# EAGLE design p128 (EAGLE 9.6.2)
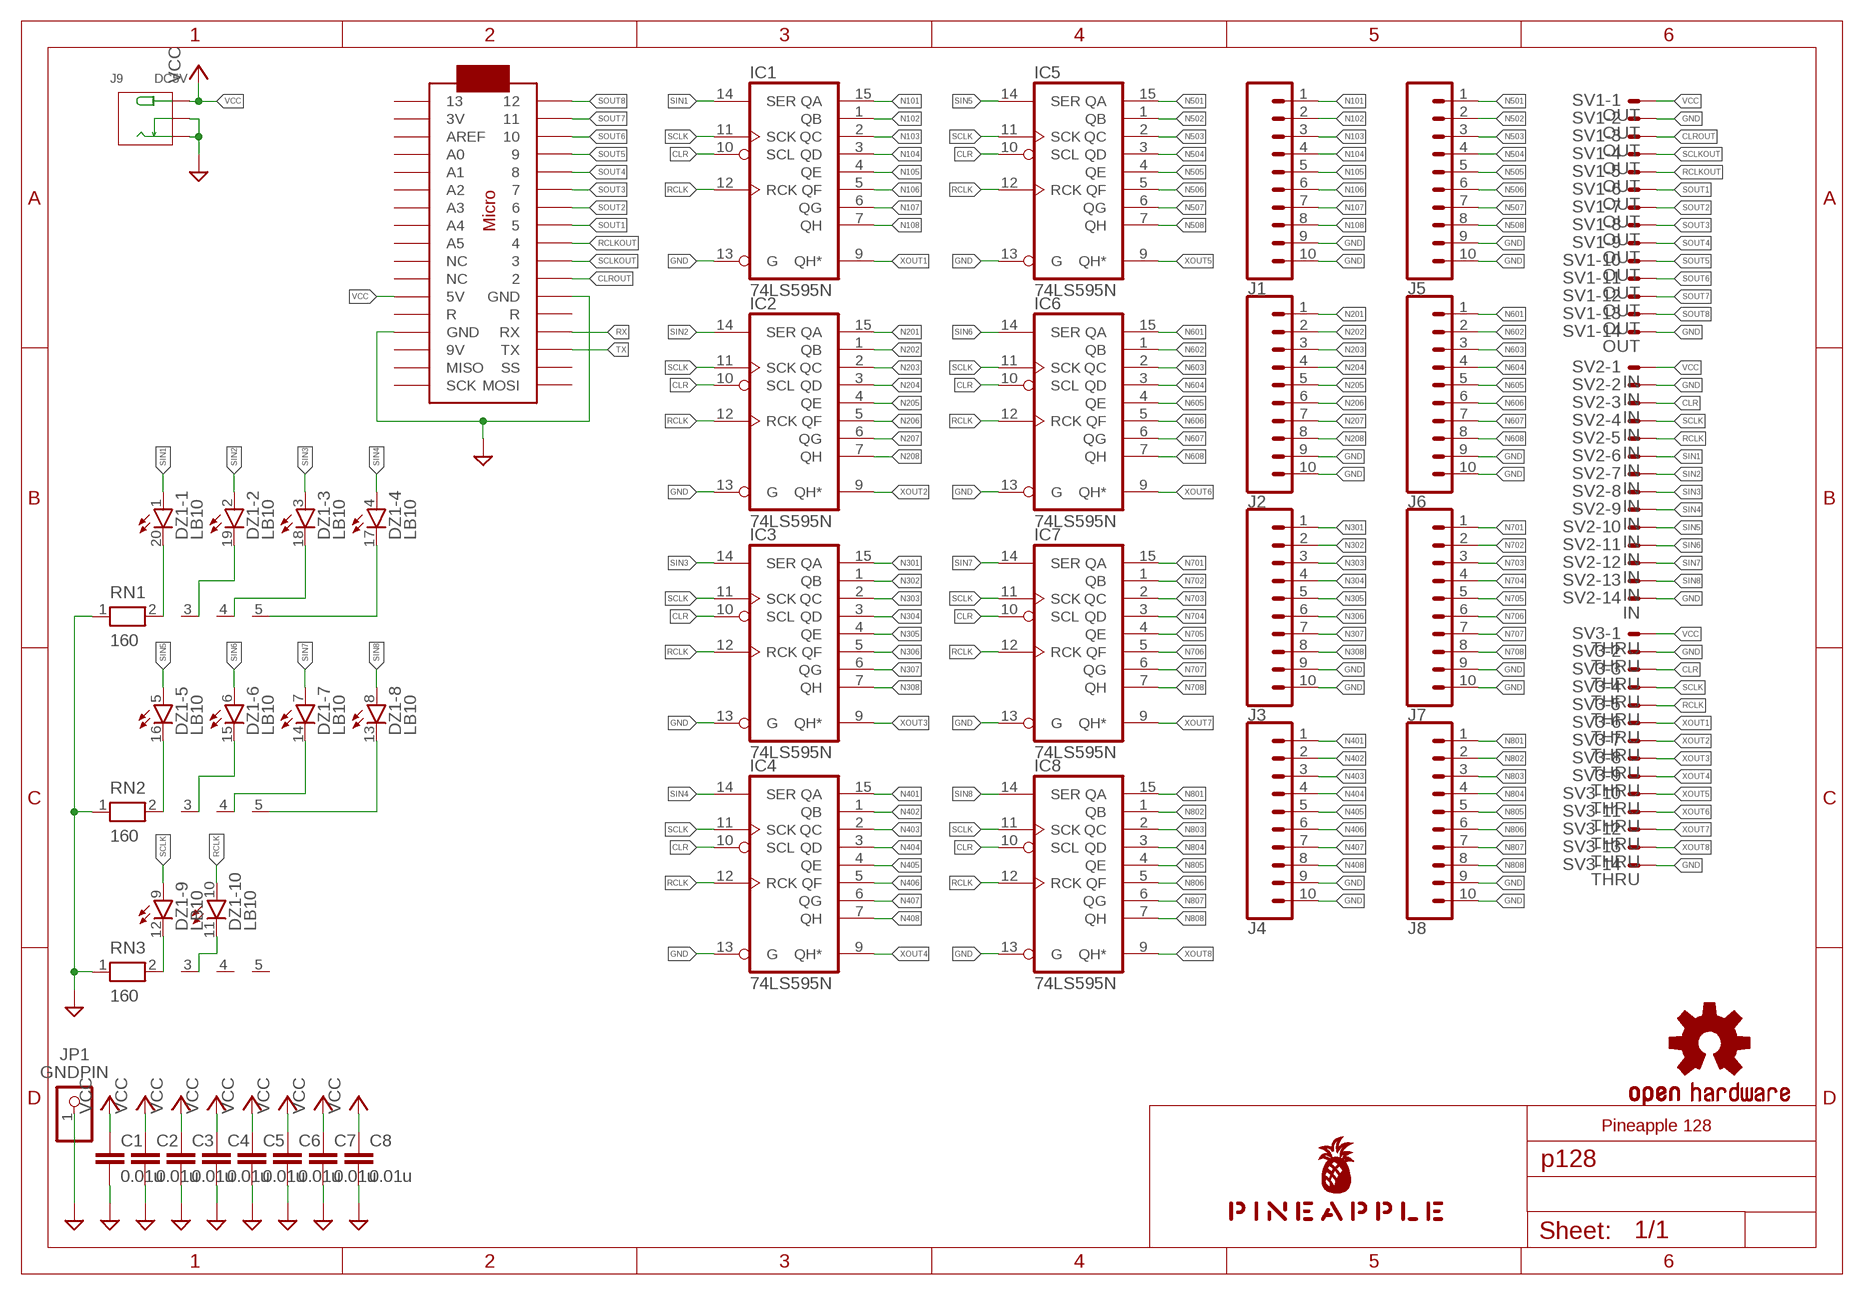
[diagram p0: schematic, sheet 1]

## Parts
C1  0.01u  C-EU025-024X044  [C025-024X044]
C2  0.01u  C-EU025-024X044  [C025-024X044]
C3  0.01u  C-EU025-024X044  [C025-024X044]
C4  0.01u  C-EU025-024X044  [C025-024X044]
C5  0.01u  C-EU025-024X044  [C025-024X044]
C6  0.01u  C-EU025-024X044  [C025-024X044]
C7  0.01u  C-EU025-024X044  [C025-024X044]
C8  0.01u  C-EU025-024X044  [C025-024X044]
DZ1  LB10  [LB10]
IC1  74LS595N  [DIL16]
IC2  74LS595N  [DIL16]
IC3  74LS595N  [DIL16]
IC4  74LS595N  [DIL16]
IC5  74LS595N  [DIL16]
IC6  74LS595N  [DIL16]
IC7  74LS595N  [DIL16]
IC8  74LS595N  [DIL16]
J1  CONN_10"  [1X10]
J2  CONN_10"  [1X10]
J3  CONN_10"  [1X10]
J4  CONN_10"  [1X10]
J5  CONN_10"  [1X10]
J6  CONN_10"  [1X10]
J7  CONN_10"  [1X10]
J8  CONN_10"  [1X10]
J9  DC5V  JACK-DC-005'DC-005'  [3P-L14.2*W11.0*H9.0MM]
JP1  GNDPIN  PINHD-1X1  [1X01]
LOGO1  OSHW-LOGOS-COPPER  [OSHW-LOGO-S_COPPER]
RN1  160  RN04  [RN-5]
RN2  160  RN04  [RN-5]
RN3  160  RN04  [RN-5]
SV1  OUT  ML14E  [ML14]
SV2  IN  ML14E  [ML14]
SV3  THRU  ML14E  [ML14]
U$1  PINEAPPLE450_SILK  [PINEAPPLE450_SILK]
U$2  ARDUINOMICRO  [ARDUINOMICRO]

## Nets
CLR: IC1.10(SCL) IC2.10(SCL) IC3.10(SCL) IC4.10(SCL) IC5.10(SCL) IC6.10(SCL) IC7.10(SCL) IC8.10(SCL) SV2.3 SV3.3
CLROUT: SV1.3 U$2.P$11
GND [gnd]: C1.2 C2.2 C3.2 C4.2 C5.2 C6.2 C7.2 C8.2 IC1.13(G) IC2.13(G) IC3.13(G) IC4.13(G) IC5.13(G) IC6.13(G) IC7.13(G) IC8.13(G) J1.9 J1.10 J2.9 J2.10 J3.9 J3.10 J4.9 J4.10 J5.9 J5.10 J6.9 J6.10 J7.9 J7.10 J8.9 J8.10 J9.-1(-) J9.-2(CDN) JP1.1 RN1.1 RN2.1 RN3.1 SV1.2 SV1.14 SV2.2 SV2.14 SV3.2 SV3.14 U$2.P$12(GND) U$2.P$21(GND)
N101: IC1.15(QA) J1.1
N102: IC1.1(QB) J1.2
N103: IC1.2(QC) J1.3
N104: IC1.3(QD) J1.4
N105: IC1.4(QE) J1.5
N106: IC1.5(QF) J1.6
N107: IC1.6(QG) J1.7
N108: IC1.7(QH) J1.8
N201: IC2.15(QA) J2.1
N202: IC2.1(QB) J2.2
N203: IC2.2(QC) J2.3
N204: IC2.3(QD) J2.4
N205: IC2.4(QE) J2.5
N206: IC2.5(QF) J2.6
N207: IC2.6(QG) J2.7
N208: IC2.7(QH) J2.8
N301: IC3.15(QA) J3.1
N302: IC3.1(QB) J3.2
N303: IC3.2(QC) J3.3
N304: IC3.3(QD) J3.4
N305: IC3.4(QE) J3.5
N306: IC3.5(QF) J3.6
N307: IC3.6(QG) J3.7
N308: IC3.7(QH) J3.8
N401: IC4.15(QA) J4.1
N402: IC4.1(QB) J4.2
N403: IC4.2(QC) J4.3
N404: IC4.3(QD) J4.4
N405: IC4.4(QE) J4.5
N406: IC4.5(QF) J4.6
N407: IC4.6(QG) J4.7
N408: IC4.7(QH) J4.8
N501: IC5.15(QA) J5.1
N502: IC5.1(QB) J5.2
N503: IC5.2(QC) J5.3
N504: IC5.3(QD) J5.4
N505: IC5.4(QE) J5.5
N506: IC5.5(QF) J5.6
N507: IC5.6(QG) J5.7
N508: IC5.7(QH) J5.8
N601: IC6.15(QA) J6.1
N602: IC6.1(QB) J6.2
N603: IC6.2(QC) J6.3
N604: IC6.3(QD) J6.4
N605: IC6.4(QE) J6.5
N606: IC6.5(QF) J6.6
N607: IC6.6(QG) J6.7
N608: IC6.7(QH) J6.8
N701: IC7.15(QA) J7.1
N702: IC7.1(QB) J7.2
N703: IC7.2(QC) J7.3
N704: IC7.3(QD) J7.4
N705: IC7.4(QE) J7.5
N706: IC7.5(QF) J7.6
N707: IC7.6(QG) J7.7
N708: IC7.7(QH) J7.8
N801: IC8.15(QA) J8.1
N802: IC8.1(QB) J8.2
N803: IC8.2(QC) J8.3
N804: IC8.3(QD) J8.4
N805: IC8.4(QE) J8.5
N806: IC8.5(QF) J8.6
N807: IC8.6(QG) J8.7
N808: IC8.7(QH) J8.8
N$1: DZ1.20(-1:C) RN1.2
N$2: DZ1.19(-2:C) RN1.3
N$3: DZ1.18(-3:C) RN1.4
N$4: DZ1.17(-4:C) RN1.5
N$5: DZ1.16(-5:C) RN2.2
N$6: DZ1.15(-6:C) RN2.3
N$7: DZ1.14(-7:C) RN2.4
N$8: DZ1.13(-8:C) RN2.5
N$9: DZ1.12(-9:C) RN3.2
N$10: DZ1.11(-10:C) RN3.3
RCLK: DZ1.10(-10:A) IC1.12(RCK) IC2.12(RCK) IC3.12(RCK) IC4.12(RCK) IC5.12(RCK) IC6.12(RCK) IC7.12(RCK) IC8.12(RCK) SV2.5 SV3.5
RCLKOUT: SV1.5 U$2.P$9
RX: U$2.P$14(RX)
SCLK: DZ1.9(-9:A) IC1.11(SCK) IC2.11(SCK) IC3.11(SCK) IC4.11(SCK) IC5.11(SCK) IC6.11(SCK) IC7.11(SCK) IC8.11(SCK) SV2.4 SV3.4
SCLKOUT: SV1.4 U$2.P$10
SIN1: DZ1.1(-1:A) IC1.14(SER) SV2.6
SIN2: DZ1.2(-2:A) IC2.14(SER) SV2.7
SIN3: DZ1.3(-3:A) IC3.14(SER) SV2.8
SIN4: DZ1.4(-4:A) IC4.14(SER) SV2.9
SIN5: DZ1.5(-5:A) IC5.14(SER) SV2.10
SIN6: DZ1.6(-6:A) IC6.14(SER) SV2.11
SIN7: DZ1.7(-7:A) IC7.14(SER) SV2.12
SIN8: DZ1.8(-8:A) IC8.14(SER) SV2.13
SOUT1: SV1.6 U$2.P$8
SOUT2: SV1.7 U$2.P$7
SOUT3: SV1.8 U$2.P$6
SOUT4: SV1.9 U$2.P$5
SOUT5: SV1.10 U$2.P$4
SOUT6: SV1.11 U$2.P$3
SOUT7: SV1.12 U$2.P$2
SOUT8: SV1.13 U$2.P$1
TX: U$2.P$15(TX)
VCC [power]: C1.1 C2.1 C3.1 C4.1 C5.1 C6.1 C7.1 C8.1 J9.+ SV1.1 SV2.1 SV3.1 U$2.P$23(5V)
XOUT1: IC1.9(QH*) SV3.6
XOUT2: IC2.9(QH*) SV3.7
XOUT3: IC3.9(QH*) SV3.8
XOUT4: IC4.9(QH*) SV3.9
XOUT5: IC5.9(QH*) SV3.10
XOUT6: IC6.9(QH*) SV3.11
XOUT7: IC7.9(QH*) SV3.12
XOUT8: IC8.9(QH*) SV3.13
Unconnected: RN3.4 RN3.5 U$2.P$13(R) U$2.P$16(SS) U$2.P$17(MOSI) U$2.P$18(SCK) U$2.P$19(MISO) U$2.P$20(9V) U$2.P$22(R) U$2.P$24(NC) U$2.P$25(NC) U$2.P$26(A5) U$2.P$27(A4) U$2.P$28(A3) U$2.P$29(A2) U$2.P$30(A1) U$2.P$31(A0) U$2.P$32(AREF) U$2.P$33(3V) U$2.P$34

## Notes on the sheet
- Pineapple 128

## Power pins joined to a net without a drawn wire
GND: IC1.8(GND) IC2.8(GND) IC3.8(GND) IC4.8(GND) IC5.8(GND) IC6.8(GND) IC7.8(GND) IC8.8(GND)
VCC: IC1.16(VCC) IC2.16(VCC) IC3.16(VCC) IC4.16(VCC) IC5.16(VCC) IC6.16(VCC) IC7.16(VCC) IC8.16(VCC)

## Library data of the parts
C1-C8 = resistor:C-EU: CAPACITOR, European symbol
DZ1 = led:LB10: LED BLOCK 10-LED bar graph, DIL, Siemens
IC1-IC8 = 74xx-us:74*595: 8-bit SHIFT REGISTER, output latch
J1-J8 = SparkFun-Connectors:CONN_10: Multi connection point. Often used as Generic Header-pin footprint for 0.1 inch spaced/style header connections On any of the 0.1 inch spaced packages, you can populate with these: Break Away Headers - Straight <https://www.sparkfun.com/products/116> (PRT-00116) Break Away Male Headers - Right Angle <https://www.sparkfun.com/products/553> (PRT-00553) Female Headers <https://www.sparkfun.com/products/115> (PRT-00115) Break Away Headers - Machine Pin <https://www.sparkfun.com/products/117> (PRT-00117) Break Away Female Headers - Swiss Machine Pin <https://www.sparkfun.com/products/743> (PRT-00743) Arduino Stackable Header - 10 Pin <https://www.sparkfun.com/products/11376> (PRT-11376) For SCREWTERMINALS and SPRING TERMINALS visit here: Screw Terimnals on SparkFun.com <https://www.sparkfun.com/search/results?term=Screw+Terminals> (5mm/3.5mm/2.54mm spacing) This device is also useful as a general connection point to wire up your design to another part of your project. Our various solder wires solder well into these plated through hole pads. Hook-Up Wire - Assortment (Stranded, 22 AWG) <https://www.sparkfun.com/products/11375> (PRT-11375) Hook-Up Wire - Assortment (Solid Core, 22 AWG) <https://www.sparkfun.com/products/11367> (PRT-11367) View the entire wire category on our website here <https://www.sparkfun.com/categories/141> Special notes: Molex polarized connector foot print use with SKU : PRT-08231 with associated crimp pins and housings. 1MM SMD Version SKU: PRT-10208 NOTES ON THE VARIANTS LOCK and LOCK_LONGPADS... This footprint was designed to help hold the alignment of a through-hole component (i.e. 6-pin header) while soldering it into place. You may notice that each hole has been shifted either up or down by 0.005 of an inch from it's more standard position (which is a perfectly straight line). This slight alteration caused the pins (the squares in the middle) to touch the edges of the holes. Because they are alternating, it causes a "brace" to hold the component in place. 0.005 has proven to be the perfect amount of "off-center" position when using our standard breakaway headers. Although looks a little odd when you look at the bare footprint, once you have a header in there, the alteration is very hard to notice. Also,if you push a header all the way into place, it is covered up entirely on the bottom side.; PROD_ID: CONN-11563
J9 = Seeed-Connector:JACK-DC-005: 320120003
JP1 = pinhead:PINHD-1X1: PIN HEADER
LOGO1 = SparkFun-Aesthetics:OSHW-LOGO: Open-Source Hardware (OSHW) Logo This logo indicates the piece of hardware it is found on incorporates a OSHW license and/or adheres to the definition of open source hardware found here: http://freedomdefined.org/OSHW
RN1-RN3 = resistor-net:RN04: RESISTOR NETWORK; OC_FARNELL: unknown; OC_NEWARK: unknown
SV1-SV3 = con-ml:ML14E: HARTING; OC_FARNELL: unknown; OC_NEWARK: unknown
U$1 = pineapple:PINEAPPLE450_SILK
U$2 = adafruit:ARDUINOMICRO

## Net classes
0 default: width 0.152 mm, drill 0.152 mm, clearance 0.152 mm
1 gnd: width 0.305 mm, drill 0.152 mm, clearance 0.152 mm
2 power: width 0.305 mm, drill 0.152 mm, clearance 0.152 mm
3 analog: width 0.152 mm, drill 0.152 mm, clearance 0.152 mm

## Board
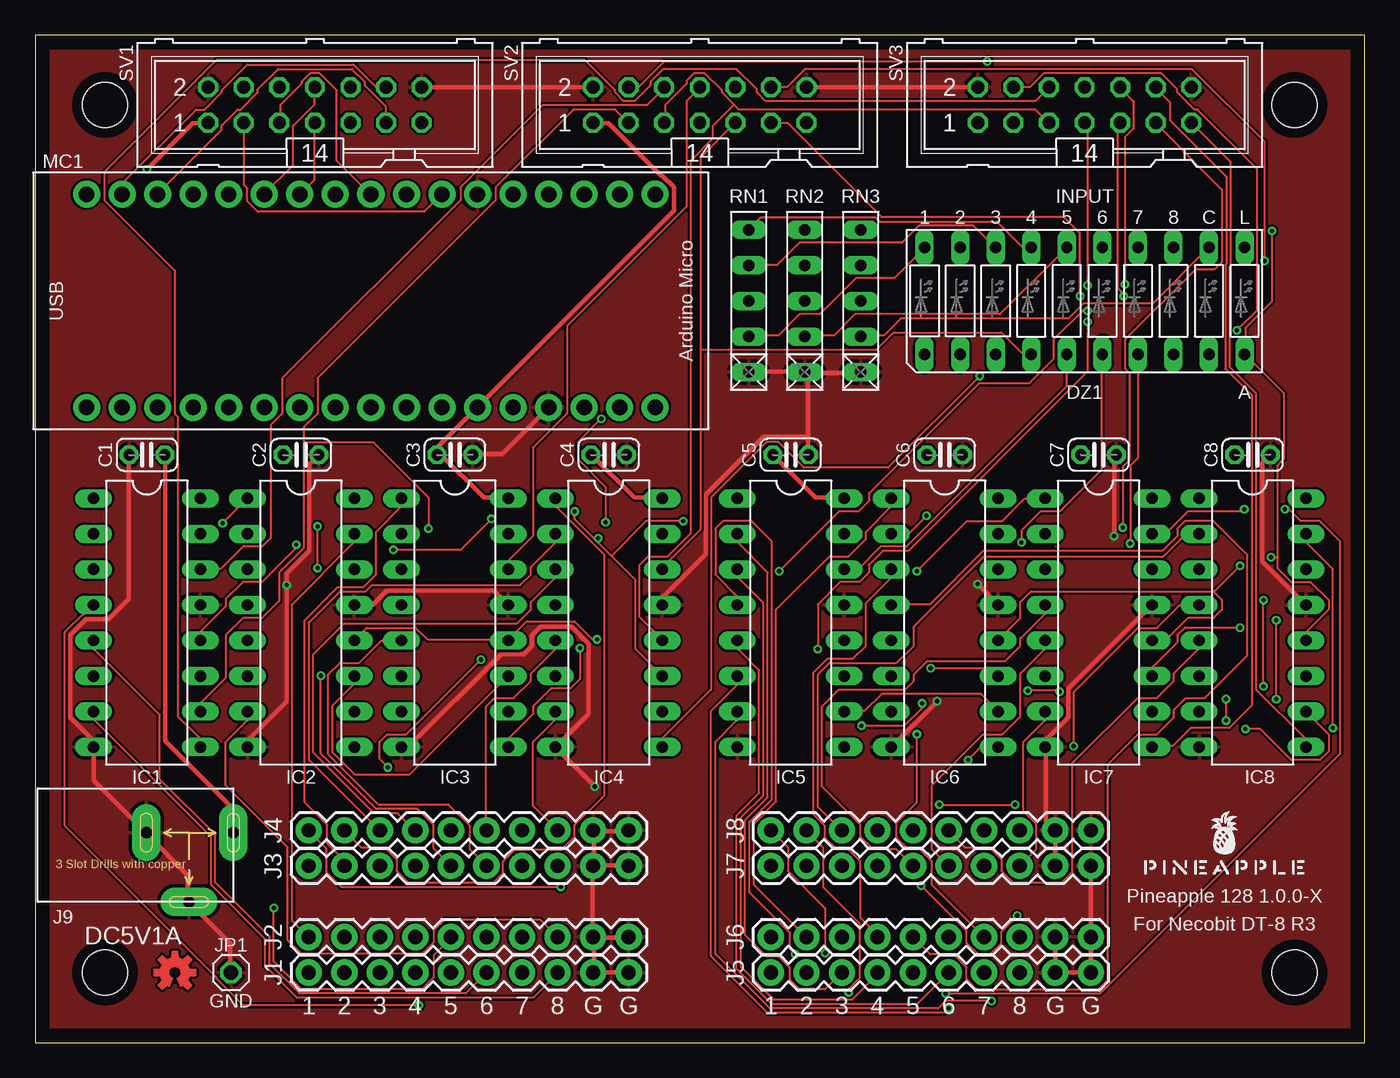
[diagram p1: board, top side]
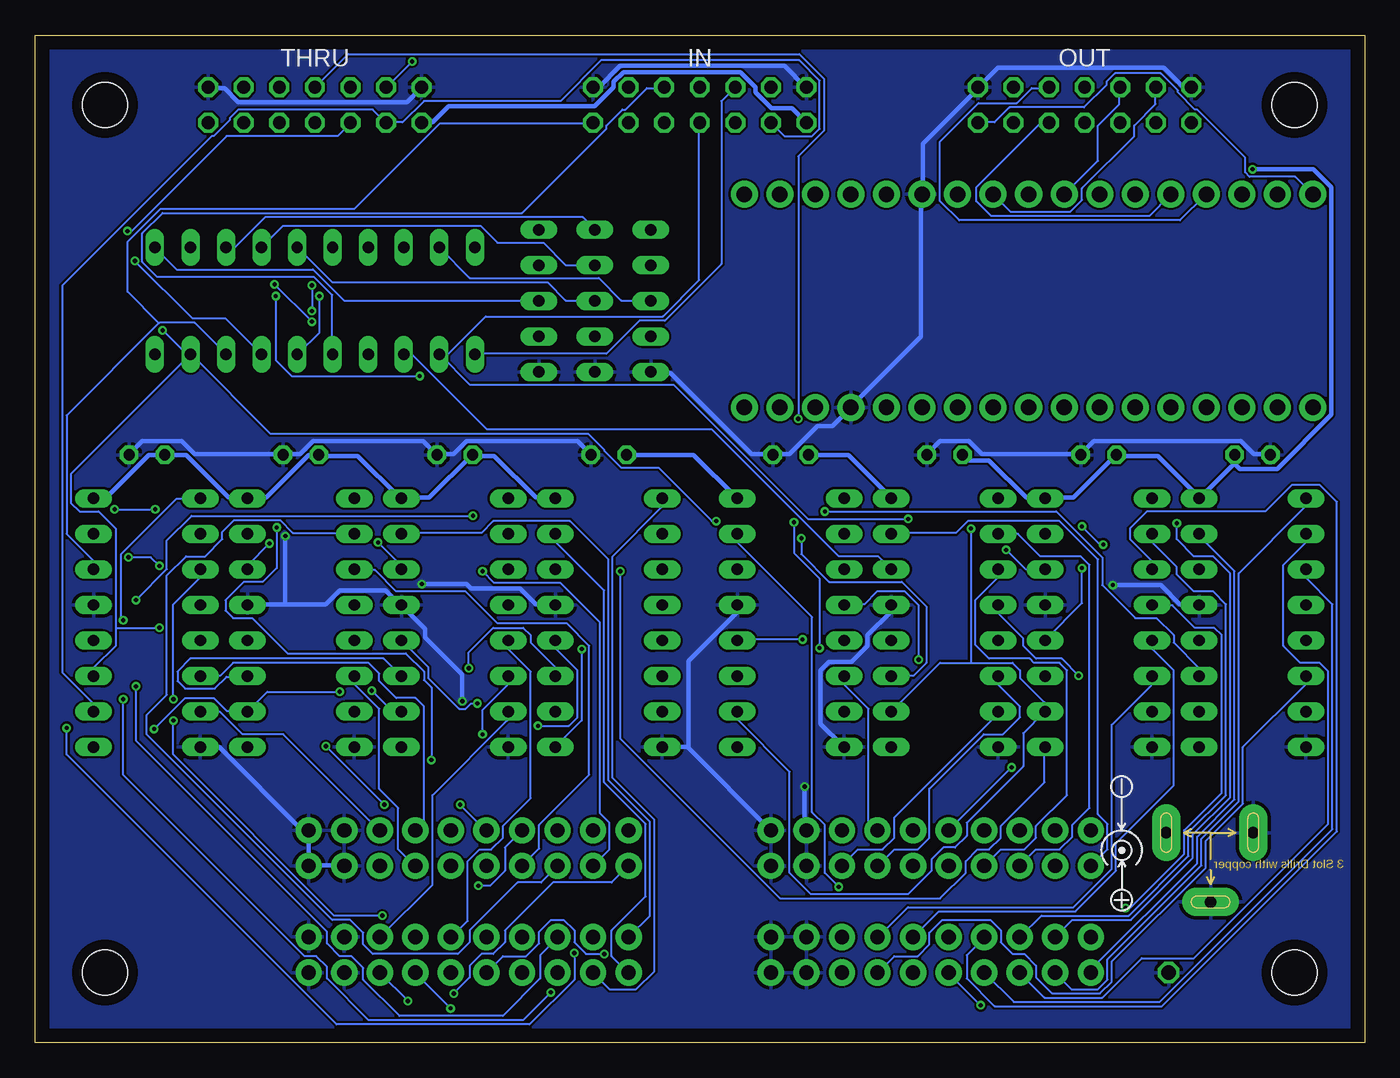
[diagram p2: board, bottom side, seen from below]

Size 95 x 72 mm. Coordinates in mm from the lower left corner, seen from the top.
Outline: 0,0 95,0 95,72 0,72 0,0
Copper layers (1*16): Top 0.035mm / dielectric 1.5mm / Bottom 0.035mm
Design rules "SeeedStudio_2layer_DRU_no_angle_20140221": minimum track width 6mil, minimum drill 12mil, track to track 6mil, track to pad 6mil, pad to pad 6mil, via to via 6mil, smd to smd 0mil, copper to edge 10mil, drill to drill 10mil, minimum pad ring 10mil, minimum via ring 6mil, stop-mask expansion 2mil, vias tented up to drill 100mil, thermal gap 10mil
Holes 3.2 mm at 5,5 90,5 90,67 5,67
tRestrict: area 2.8,64.8 to 7.2,69.2; area 87.8,64.8 to 92.2,69.2; area 2.8,2.8 to 7.2,7.2; area 87.8,2.8 to 92.2,7.2; area 0,71 to 95,72; area 94,0 to 95,72; area 0,0 to 95,1; area 0,0 to 1,72
bRestrict: area 2.8,2.8 to 7.2,7.2; area 87.8,2.8 to 92.2,7.2; area 87.8,64.8 to 92.2,69.2; area 2.8,64.8 to 7.2,69.2; area 0,71 to 95,72; area 94,0 to 95,72; area 0,0 to 95,1; area 0,0 to 1,72

### Footprints (pad centres in the part's own frame; a part is rotated, then mirrored left to right if it is on the bottom)
C025-024X044 = drill 0.813 octagon: 1 -1.27,0; 2 1.27,0
LB10 = drill 0.813 long: 1 -11.43,-3.81; 2 -8.89,-3.81; 3 -6.35,-3.81; 4 -3.81,-3.81; 5 -1.27,-3.81; 6 1.27,-3.81; 7 3.81,-3.81; 8 6.35,-3.81; 9 8.89,-3.81; 10 11.43,-3.81; 11 11.43,3.81; 12 8.89,3.81; 13 6.35,3.81; 14 3.81,3.81; 15 1.27,3.81; 16 -1.27,3.81; 17 -3.81,3.81; 18 -6.35,3.81; 19 -8.89,3.81; 20 -11.43,3.81
DIL16 = drill 0.813 long: 1 -8.89,-3.81; 2 -6.35,-3.81; 3 -3.81,-3.81; 4 -1.27,-3.81; 5 1.27,-3.81; 6 3.81,-3.81; 7 6.35,-3.81; 8 8.89,-3.81; 9 8.89,3.81; 10 6.35,3.81; 11 3.81,3.81; 12 1.27,3.81; 13 -1.27,3.81; 14 -3.81,3.81; 15 -6.35,3.81; 16 -8.89,3.81
1X10 = drill 1.016 pad 1.88: 1 0,0; 2 2.54,0; 3 5.08,0; 4 7.62,0; 5 10.16,0; 6 12.7,0; 7 15.24,0; 8 17.78,0; 9 20.32,0; 10 22.86,0
3P-L14.2*W11.0*H9.0MM = drill 0.813 pad 2.032 long: + 3.175,0; -1 -3.048,0; -2 0,-4.953
1X01 = drill 1.016 octagon: 1 0,0
RN-5 = drill 0.813 long: 1 -5.08,0; 2 -2.54,0; 3 0,0; 4 2.54,0; 5 5.08,0
ML14 = drill 0.914 octagon: 1 -7.62,-1.27; 2 -7.62,1.27; 3 -5.08,-1.27; 4 -5.08,1.27; 5 -2.54,-1.27; 6 -2.54,1.27; 7 0,-1.27; 8 0,1.27; 9 2.54,-1.27; 10 2.54,1.27; 11 5.08,-1.27; 12 5.08,1.27; 13 7.62,-1.27; 14 7.62,1.27
ARDUINOMICRO = drill 1.1 pad 1.93: P$1 -20.32,7.62; P$2 -17.78,7.62; P$3 -15.24,7.62; P$4 -12.7,7.62; P$5 -10.16,7.62; P$6 -7.62,7.62; P$7 -5.08,7.62; P$8 -2.54,7.62; P$9 0,7.62; P$10 2.54,7.62; P$11 5.08,7.62; P$12 12.7,-7.62; P$13 10.16,-7.62; P$14 12.7,7.62; P$15 15.24,7.62; P$16 17.78,7.62; P$17 20.32,7.62; P$18 20.32,-7.62; P$19 17.78,-7.62; P$20 15.24,-7.62; P$21 7.62,7.62; P$22 10.16,7.62; P$23 7.62,-7.62; P$24 5.08,-7.62; P$25 2.54,-7.62; P$26 0,-7.62; P$27 -2.54,-7.62; P$28 -5.08,-7.62; P$29 -7.62,-7.62; P$30 -10.16,-7.62; P$31 -12.7,-7.62; P$32 -15.24,-7.62; P$33 -17.78,-7.62; P$34 -20.32,-7.62

### Placement (x,y rotation side)
C1  8,42 180 top
C2  19,42 0 top
C3  30,42 0 top
C4  41,42 0 top
C5  54,42 0 top
C6  65,42 0 top
C7  76,42 0 top
C8  87,42 0 top
DZ1  75,53 0 top
IC1  8,30 270 top
IC2  19,30 270 top
IC3  30,30 270 top
IC4  41,30 270 top
IC5  54,30 270 top
IC6  65,30 270 top
IC7  76,30 270 top
IC8  87,30 270 top
J1  19.56,5 0 top
J2  19.56,7.54 0 top
J3  19.56,12.62 0 top
J4  19.56,15.16 0 top
J5  52.58,5 0 top
J6  52.58,7.54 0 top
J7  52.58,12.62 0 top
J8  52.58,15.16 0 top
J9  11,15 0 top
JP1  14,5 0 top
LOGO1  10,5 0 top
RN1  51,53 90 top
RN2  55,53 90 top
RN3  59,53 90 top
SV1  20,67 0 top
SV2  47.5,67 0 top
SV3  75,67 0 top
U$1  85,12 0 top
U$2  24,53 0 top

### Tracks (layer width: path | path; a pad name or v marks a point on that pad's centre or on a via)
CLR  (via drill 0.3)
  Top 0.152: IC5.10 57.84,23.7 59.28,23.7 60.5,24.92 67.59,24.92 68.81,23.7 IC6.10 | v86.49,22.4 87.55,22.4 89.76,20.19 91.82,20.19 92.43,20.8 92.43,22.02 90.83,23.62 IC8.10 | v70.94,25.15 73.15,25.15 v73.23,25.07 | 19.2,42.9 19.2,43.97 20.19,44.96 20.19,47.47 32.92,60.2 32.92,61.11 38.48,66.67 41.45,66.67 42.37,65.76 SV2.3 | 19.2,42.9 19.2,35.36 17.45,33.6 17.45,31.55 16.23,30.33 14.86,30.33 13.64,29.11 13.64,26.06 11.81,24.23 11.81,23.7 IC1.10 | v28.12,36.73 28.12,38.94 24.16,42.9 19.2,42.9
  Bottom 0.152: 28.12,27.13 30.33,27.13 33.76,23.7 IC3.10 | 28.12,27.13 25.15,27.13 24.61,26.59 24.61,26.06 22.86,24.31 22.86,23.7 IC2.10 22.86,23.62 24.38,22.1 24.38,19.74 28.42,15.7 28.42,14.78 29.26,13.95 30.1,13.95 30.94,13.11 30.94,12.27 32.61,10.59 39.55,10.59 41.07,12.12 41.07,19.36 44.81,23.09 44.81,23.62 IC4.10 | v86.49,22.4 84.28,24.61 82.22,24.61 81.31,23.7 79.86,23.7 IC7.10 79.78,23.7 78.41,25.07 v73.23,25.07 | v70.94,25.15 69.49,23.7 68.89,23.7 IC6.10 | SV2.3 42.37,65.68 41.45,64.77 39.47,64.77 38.94,65.3 38.94,68.73 40.39,70.18 54.56,70.18 57.45,67.28 67.21,67.28 68.73,65.76 69.88,65.76 SV3.3 69.95,65.76 70.87,66.67 80.47,66.67 81.08,66.06 81.08,65.91 82.22,64.77 82.37,64.77 93.04,54.1 93.04,26.44 90.83,24.23 90.83,23.7 IC8.10 | v28.12,36.73 28.12,27.13
CLROUT
  Top 0.152: SV1.3 14.94,65.68 14.94,61.27 15.16,61.04 15.16,60.12 15.93,59.36 27.81,59.36 29.03,60.58 U$2.P$11
GND  (via drill 0.3)
  Top 0.305: SV2.14 55.17,68.28 67.36,68.28 SV3.2 | SV2.2 39.85,68.28 27.66,68.28 SV1.14 | IC2.13 22.86,31.32 24.16,31.32 25.15,32.31 32.77,32.31 33.76,31.32 IC3.13 | IC3.8 26.21,21.18 26.75,21.18 33.3,27.74 34.9,27.74 35.51,28.35 35.51,29.11 36.12,29.72 38.33,29.72 39.55,28.5 39.55,23.47 37.26,21.18 IC4.8 37.26,21.03 v40.01,18.29 | J2.9 39.93,7.47 39.93,5.03 J1.9 40.08,5.03 42.37,5.03 J1.10 | J2.10 42.37,7.47 40.08,7.47 J2.9 | J3.9 39.93,12.65 39.93,15.09 J4.9 40.08,15.09 42.37,15.09 J4.10 | J3.10 42.37,12.65 40.08,12.65 J3.9 | J2.9 39.85,7.7 39.85,12.5 J3.9 | JP1.1 13.95,5.03 13.95,7.09 11.05,9.98 J9.-2 10.9,10.13 10.9,11.96 8,14.86 J9.-1 7.92,15.01 4.19,18.75 IC1.8 4.19,21.26 4.19,21.57 2.52,23.24 2.52,29.11 3.66,30.25 5.26,30.25 6.71,31.7 6.71,41.99 C1.2 | IC2.8 15.24,21.18 15.24,21.64 17.98,24.38 v17.98,32.69 17.98,33.53 19.58,35.13 19.58,41.3 20.27,41.99 C2.2 | J7.9 72.92,12.65 72.92,15.01 J8.9 72.85,15.16 72.24,15.77 72.24,21.11 IC7.8 72.24,21.26 72.24,21.64 73.84,23.24 73.84,25.3 79.78,31.24 IC7.13 | J6.9 72.92,7.47 72.92,5.03 J5.9 73.08,5.03 75.44,5.03 J5.10 75.44,5.18 75.44,7.47 J6.10 75.44,7.62 75.44,12.57 J7.10 | v67.36,32.77 68.81,31.32 IC6.13 | v64.47,24.38 61.27,21.18 IC6.8 | IC8.13 90.75,31.32 87.71,34.37 87.71,41.45 88.24,41.99 C8.2 | C3.2 31.32,42.06 33.38,42.06 36.65,45.34 U$2.P$12 | 55.24,43.28 55.24,47.62 55.02,47.85 RN2.1 | 55.24,43.28 55.24,42.06 C5.2 | RN1.1 51.05,47.93 54.86,47.93 RN2.1 | RN3.1 58.98,47.85 55.47,47.85 55.32,47.7 RN2.1 | v77.11,36.2 77.11,41.83 77.27,41.99 C7.2 | 55.24,43.28 52.05,43.28 47.93,39.17 47.93,34.9 44.88,31.85 44.88,31.32 IC4.13
  Bottom 0.305: SV3.14 82.6,68.2 81.46,68.2 80.47,67.21 68.43,67.21 67.44,68.2 SV3.2 | SV1.2 12.42,68.28 12.95,68.28 14.33,69.65 26.21,69.65 27.58,68.28 SV1.14 27.66,68.12 31.55,64.24 31.55,60.66 U$2.P$21 31.7,60.5 31.7,50.44 36.65,45.49 U$2.P$12 36.73,45.34 38.02,44.04 39.09,44.04 41.07,42.06 42.22,42.06 C4.2 42.37,42.06 43.81,42.06 49.61,47.85 50.98,47.85 RN1.1 | SV2.14 55.09,68.28 54.71,68.28 53.19,69.8 41.45,69.8 39.93,68.28 SV2.2 | IC3.13 33.83,31.24 33.83,30.79 35.51,29.11 35.51,28.35 36.65,27.2 38.25,27.2 38.86,26.59 38.86,22.78 37.26,21.18 IC4.8 | 48.39,21.11 50.14,21.11 IC5.8 | 48.39,21.11 42.44,15.16 J4.10 | IC4.13 44.88,31.24 44.88,30.71 48.31,27.28 48.31,21.18 48.39,21.11 | v40.01,18.29 40.01,15.24 39.93,15.16 J4.9 | v17.98,32.69 14.55,32.69 13.18,31.32 11.81,31.32 IC1.13 | C1.2 6.78,42.06 7.92,42.06 8.84,42.98 19.36,42.98 20.27,42.06 C2.2 20.42,42.06 27.36,42.06 28.27,42.98 30.33,42.98 31.24,42.06 C3.2 | IC8.8 83.13,21.11 81.84,21.11 75.89,15.16 75.51,15.16 J8.10 75.44,15.01 75.44,12.65 J7.10 75.29,12.65 72.92,12.65 J7.9 | v67.36,32.77 64.16,32.77 63.86,32.46 60.35,32.46 59.21,31.32 57.84,31.32 IC5.13 | v64.47,24.38 64.47,26.29 67.13,28.96 67.13,29.57 68.81,31.24 IC6.13 68.96,31.32 69.95,32.31 73.23,32.31 74.22,31.32 77.11,31.32 | 77.11,31.32 79.78,31.32 IC7.13 | C8.2 88.24,42.06 87.33,42.98 84.51,42.98 83.59,42.06 77.34,42.06 C7.2 77.19,42.06 76.05,42.06 75.13,42.98 67.28,42.98 66.37,42.06 C6.2 66.22,42.06 65.08,42.06 64.16,42.98 56.24,42.98 55.32,42.06 C5.2 | v77.11,36.2 77.11,31.32
  pour Top: -1,-1 96,-1 96,73 -1,73
  pour Bottom: -2,-2 97,-2 97,74 -2,74
N101
  Bottom 0.152: IC1.15 11.73,36.35 11.73,36.12 9.3,33.68 9.3,17.37 11.96,14.71 11.96,12.8 19.51,5.26 19.51,5.03 J1.1
N102
  Bottom 0.152: IC1.1 4.19,38.86 4.19,38.33 8.99,33.53 8.99,17.22 11.66,14.55 11.66,12.65 18.36,5.94 18.36,4.5 19.05,3.81 20.95,3.81 22.1,4.95 J1.2
N103
  Bottom 0.152: IC1.2 4.19,35.74 5.79,34.14 5.79,28.35 4.57,27.13 3.2,27.13 2.59,26.52 2.59,15.62 12.19,6.02 15.93,6.02 18.75,3.2 22.86,3.2 24.61,4.95 J1.3
N104
  Bottom 0.152: IC1.3 4.12,33.76 4.12,33.15 2.29,31.32 2.29,15.24 14.63,2.9 25.07,2.9 27.13,4.95 J1.4
N105  (via drill 0.3)
  Top 0.152: v27.43,2.67 14.86,2.67 12.95,4.57 12.95,4.65 2.13,15.47 2.13,29.34 3.43,30.63 3.5,30.63 4.12,31.24 IC1.4
  Bottom 0.152: v27.43,2.67 29.72,4.95 J1.5
N106
  Top 0.152: IC1.5 4.19,28.12 8.91,23.39 8.91,18.82 12.88,14.86 12.88,11.43 16.76,7.54 16.76,5.64 18.9,3.5 30.79,3.5 32.23,4.95 J1.6
N107
  Bottom 0.152: IC1.6 4.19,26.14 4.19,25.6 8.69,21.11 8.69,17.07 11.35,14.4 11.35,12.5 18.06,5.79 18.06,4.34 18.9,3.5 22.33,3.5 23.47,4.65 23.47,5.49 24.31,6.33 25.15,6.33 25.98,7.16 25.98,8 26.75,8.76 30.18,8.76 31.09,7.85 31.09,7.01 31.93,6.17 33.6,6.17 34.75,5.03 J1.7
N108
  Top 0.152: IC1.7 4.19,23.62 4.19,23.09 12.57,14.71 12.57,11.28 16.46,7.39 16.46,5.49 18.75,3.2 35.59,3.2 37.34,4.95 J1.8
N201
  Top 0.152: IC2.15 22.78,36.35 22.78,35.74 18.36,31.32 18.36,8.69 19.51,7.54 J2.1
N202  (via drill 0.3)
  Top 0.152: v13.41,37.11 15.16,38.86 IC2.1
  Bottom 0.152: v13.41,37.11 13.41,35.97 12.19,34.75 10.82,34.75 9.6,33.53 9.6,17.53 12.27,14.86 12.27,13.18 16.69,8.76 20.88,8.76 J2.2
N203
  Bottom 0.152: IC2.2 15.16,36.35 15.16,35.74 13.41,33.98 13.41,33.45 12.19,32.23 10.82,32.23 9.91,31.32 9.91,17.68 12.57,15.01 12.57,13.34 16.84,9.07 23.09,9.07 24.61,7.54 J2.3
N204
  Bottom 0.152: IC2.3 15.24,33.83 15.24,34.44 16.76,35.97 16.76,36.73 15.54,37.95 7.09,37.95 5.18,39.85 3.2,39.85 1.98,38.63 1.98,15.09 14.48,2.59 26.44,2.59 28.42,4.57 28.42,6.25 27.2,7.47 J2.4
N205  (via drill 0.3)
  Top 0.152: v17.07,9.6 17.07,5.79 19.05,3.81 27.66,3.81 28.5,4.65 28.5,6.25 29.72,7.47 J2.5
  Bottom 0.152: v17.07,9.6 16.76,9.6 12.88,13.49 12.88,15.16 10.21,17.83 10.21,29.11 10.74,29.64 12.12,29.64 13.72,31.24 15.16,31.24 IC2.4
N206
  Bottom 0.152: IC2.5 15.16,28.73 15.16,28.12 13.64,26.59 13.64,18.36 17.75,14.25 17.75,12.27 20.65,9.37 30.4,9.37 32.23,7.54 J2.6
N207
  Bottom 0.152: IC2.6 15.24,26.14 15.24,25.53 18.06,22.71 18.06,12.42 20.8,9.68 32.61,9.68 34.75,7.54 J2.7
N208
  Top 0.152: IC2.7 15.16,23.62 15.16,23.01 13.64,21.49 13.64,18.36 18.06,13.95 18.06,7.32 19.05,6.33 27.66,6.33 28.5,7.16 28.5,8 29.26,8.76 36.12,8.76 J2.8
N301
  Bottom 0.152: IC3.15 33.76,36.42 29.18,36.42 28.35,37.26 21.79,37.26 19.05,34.52 19.05,16.31 18.36,15.62 18.36,13.79 19.51,12.65 J3.1
N302
  Top 0.152: IC3.1 26.14,38.86 26.14,38.25 24.38,36.5 24.38,33.45 23.47,32.54 21.64,32.54 19.28,30.18 19.28,17.14 20.88,15.54 20.88,14.25 22.1,13.03 22.1,12.65 J3.2
N303
  Bottom 0.152: IC3.2 26.14,36.35 24.77,36.35 23.16,34.75 20.27,34.75 19.66,34.14 19.66,16.76 20.88,15.54 20.88,14.71 21.79,13.79 23.47,13.79 24.61,12.65 J3.3
N304
  Bottom 0.152: IC3.3 26.21,33.76 26.21,33.22 27.81,31.62 27.81,28.42 26.82,27.43 23.93,27.43 23.62,27.13 21.79,27.13 21.26,26.59 21.26,17.68 23.47,15.47 23.47,14.63 24.31,13.79 25.98,13.79 27.13,12.65 J3.4
N305  (via drill 0.3)
  Top 0.152: v20.42,26.21 20.42,20.65 24.38,16.69 27.36,16.69 28.5,15.54 28.5,13.87 29.72,12.65 J3.5
  Bottom 0.152: v20.42,26.21 21.64,27.43 23.47,27.43 24.38,28.35 24.38,28.88 26.14,30.63 26.14,31.24 IC3.4
N306
  Top 0.152: IC3.5 26.14,28.73 24.77,28.73 23.16,27.13 21.79,27.13 20.95,26.29 20.95,20.57 24.54,16.99 29.57,16.99 31.09,15.47 31.09,13.79 32.23,12.65 J3.6
N307
  Bottom 0.152: IC3.6 26.14,26.14 26.14,25.53 24.61,24 24.61,23.24 25.83,22.02 27.2,22.02 31.09,18.14 31.09,14.63 31.93,13.79 33.6,13.79 34.75,12.65 J3.7
N308
  Bottom 0.152: IC3.7 26.21,23.62 26.21,23.47 33.6,16.08 33.6,14.63 34.44,13.79 36.2,13.79 37.34,12.65 J3.8
N401  (via drill 0.3)
  Top 0.152: v37.57,11.12 21.87,11.12 20.8,12.19 20.8,13.87 19.58,15.09 J4.1
  Bottom 0.152: v37.57,11.12 38.56,12.12 38.56,15.54 39.47,16.46 39.47,30.4 44.81,35.74 IC4.15
N402
  Top 0.152: IC4.1 37.26,38.86 37.26,38.25 40.69,34.82 40.69,17.68 38.56,15.54 38.56,14.71 37.64,13.79 34.29,13.79 33.45,12.95 33.45,12.12 32.77,11.43 26.67,11.43 25.83,12.27 25.83,13.11 24.99,13.95 23.32,13.95 22.17,15.09 J4.2
N403
  Top 0.152: IC4.2 37.19,35.74 35.43,33.98 35.43,33.45 34.67,32.69 24.08,32.69 23.62,32.23 21.79,32.23 19.58,30.02 19.58,20.19 24.61,15.16 J4.3
N404
  Top 0.152: IC4.3 37.19,33.76 37.19,33.22 35.43,31.47 35.43,30.94 34.44,29.95 22.1,29.95 19.89,27.74 19.89,20.73 24.23,16.38 25.91,16.38 27.13,15.16 J4.4
N405  (via drill 0.3)
  Top 0.152: v31.85,27.36 26.52,22.02 25.15,22.02 24.61,21.49 24.61,20.27 v25.22,19.66
  Bottom 0.152: v31.85,27.36 31.85,31.24 32.84,32.23 34.82,32.23 35.74,31.32 37.19,31.32 IC4.4 | v25.22,19.66 J4.5
N406
  Top 0.152: IC4.5 37.19,28.12 35.43,26.36 35.43,25.83 34.21,24.61 32.84,24.61 32.23,24 32.23,15.16 J4.6
N407
  Bottom 0.152: IC4.6 37.19,26.14 37.19,25.6 35.43,23.85 35.43,15.77 34.82,15.16 J4.7
N408
  Top 0.152: IC4.7 37.19,23.62 37.19,23.09 35.59,21.49 35.59,16.92 J4.8
N501
  Bottom 0.152: IC5.15 57.76,36.35 57.76,35.74 54.33,32.31 54.33,18.59 51.36,15.62 51.36,10.44 53.8,8 53.8,6.17 52.65,5.03 J5.1
N502
  Bottom 0.152: IC5.1 50.22,38.86 50.22,38.25 53.72,34.75 53.72,18.9 50.75,15.93 50.75,5.11 52.05,3.81 53.95,3.81 55.09,4.95 J5.2
N503
  Top 0.152: IC5.2 50.22,36.35 50.22,35.74 52.35,33.6 52.35,17.53 50.75,15.93 50.75,7.7 52.27,6.17 53.11,6.17 53.95,5.33 53.95,4.5 54.63,3.81 56.46,3.81 57.61,4.95 J5.3
N504
  Top 0.152: IC5.3 50.22,33.76 50.22,33.22 52.05,31.39 52.05,17.68 50.44,16.08 50.44,5.41 52.81,3.05 58.37,3.05 60.27,4.95 J5.4
N505  (via drill 0.3)
  Top 0.152: v54.33,6.33 53.95,6.71 53.95,7.85 51.05,10.74 51.05,15.77 52.65,17.37 52.65,35.81 51.21,37.26 49.15,37.26 48.62,36.73 48.62,33.45 50.14,31.93 50.14,31.32 IC5.4
  Bottom 0.152: v54.33,6.33 55.63,6.33 56.46,7.16 56.46,8 57.23,8.76 58.14,8.76 58.98,7.92 58.98,7.09 59.89,6.17 61.57,6.17 62.71,5.03 J5.5
N506
  Top 0.152: IC5.5 50.22,28.73 50.22,28.12 51.74,26.59 51.74,17.83 50.14,16.23 50.14,5.26 52.65,2.74 63.02,2.74 65.23,4.95 J5.6
N507  (via drill 0.3)
  Top 0.152: v65.3,2.44 65,2.13 52.35,2.13 48.31,6.17 48.31,23.7 50.14,25.53 50.14,26.14 IC5.6
  Bottom 0.152: v65.3,2.44 67.82,4.95 J5.7
N508  (via drill 0.3)
  Top 0.152: v68.35,2.97 65.08,2.97 64.54,2.44 52.5,2.44 48.62,6.33 48.62,21.49 50.14,23.01 50.14,23.62 IC5.7
  Bottom 0.152: v68.35,2.97 70.33,4.95 J5.8
N601
  Bottom 0.152: IC6.15 68.81,36.42 63.09,36.42 62.26,37.26 56.77,37.26 54.03,34.52 54.03,18.75 51.05,15.77 51.05,9.07 J6.1
N602
  Top 0.152: IC6.1 61.19,38.86 61.19,38.33 59.36,36.5 59.36,35.97 58.14,34.75 56.77,34.75 52.96,30.94 52.96,17.22 51.36,15.62 51.36,11.28 55.09,7.54 J6.2
N603  (via drill 0.3)
  Top 0.152: v63.7,37.64 62.48,36.42 61.27,36.42 IC6.2 | v87.78,25.45 v87.78,31.62
  Bottom 0.152: v63.7,37.64 83.82,37.64 85.57,35.89 85.57,33.83 v87.78,31.62 | v87.78,25.45 87.78,21.57 74.14,7.92 74.14,7.09 73.23,6.17 72.39,6.17 71.55,5.33 71.55,4.5 68.96,1.91 61.57,1.91 58.9,4.57 58.9,6.25 57.68,7.47 J6.3
N604
  Top 0.152: IC6.3 61.19,33.76 61.19,33.22 59.36,31.39 59.36,28.35 58.45,27.43 56.62,27.43 55.63,26.44 55.63,16.31 56.46,15.47 56.46,14.63 57.3,13.79 58.14,13.79 58.98,12.95 58.98,8.91 60.2,7.7 J6.4
N605
  Top 0.152: IC6.4 61.27,31.32 63.93,31.32 67.74,35.13 80.54,35.13 81.61,36.2 81.61,36.73 82.14,37.26 84.2,37.26 86.64,34.82 86.64,27.66 83.59,24.61 82.22,24.61 81.38,23.77 81.38,23.24 80.16,22.02 78.79,22.02 76.66,19.89 76.66,4.5 75.97,3.81 67.28,3.81 66.52,4.57 66.52,5.41 65.61,6.33 63.93,6.33 62.79,7.47 J6.5
N606
  Bottom 0.152: IC6.5 61.19,28.12 59.59,26.52 59.59,17.45 61.57,15.47 61.57,14.63 62.41,13.79 63.25,13.79 64.08,12.95 64.08,8.69 65.23,7.54 J6.6
N607  (via drill 0.3)
  Top 0.152: v63.02,22.02 63.02,17.14 61.57,15.7 61.57,14.63 62.41,13.79 63.25,13.79 64.08,12.95 64.08,11.28 J6.7
  Bottom 0.152: v63.02,22.02 63.02,23.77 61.27,25.53 61.27,26.14 IC6.6
N608
  Bottom 0.152: IC6.7 61.27,23.62 61.27,23.01 66.6,17.68 66.6,11.28 70.33,7.54 J6.8
N701  (via drill 0.3)
  Top 0.152: v86.41,38.1 86.26,37.95 82.37,37.95 80.85,36.42 79.86,36.42 IC7.15 | v89.31,38.1 89.61,38.1 90.45,37.26 91.82,37.26 93.27,35.81 93.27,20.65 76.12,3.5 v65.08,3.5
  Bottom 0.152: v89.31,38.1 v86.41,38.1 | v65.08,3.5 63.93,4.65 63.93,5.49 63.09,6.33 62.26,6.33 61.42,7.16 61.42,8 57.99,11.43 53.8,11.43 52.65,12.57 J7.1
N702  (via drill 0.3)
  Top 0.152: v63.02,33.68 66.6,37.26 69.11,37.26 70.71,38.86 72.16,38.86 IC7.1
  Bottom 0.152: v63.02,33.68 62.18,32.84 57.45,32.84 54.63,30.02 54.63,16.38 53.95,15.7 53.95,13.79 55.09,12.65 J7.2
N703
  Bottom 0.152: IC7.2 72.24,36.42 76.58,36.42 77.5,37.34 80.77,37.34 81.61,36.5 81.61,35.97 82.83,34.75 84.2,34.75 85.57,33.38 85.57,24.84 87.02,23.39 87.02,22.02 73.76,8.76 72.47,8.76 71.55,7.85 71.55,7.01 70.87,6.33 64.77,6.33 63.93,7.16 63.93,8 60.5,11.43 58.83,11.43 57.68,12.57 J7.3
N704
  Bottom 0.152: IC7.3 72.16,33.76 70.71,33.76 69.19,32.23 64.24,32.23 61.95,29.95 57,29.95 55.4,28.35 55.4,19.13 58.98,15.54 58.98,13.87 60.2,12.65 J7.4
N705
  Top 0.152: IC7.4 72.16,31.24 72.16,30.63 70.41,28.88 70.41,28.35 69.34,27.28 63.78,27.28 62.79,26.29 62.79,25.83 62.18,25.22 57.45,25.22 56.24,24 56.24,18.29 58.98,15.54 58.98,14.71 59.89,13.79 61.57,13.79 62.71,12.65 J7.5
N706
  Top 0.152: IC7.5 72.16,28.73 72.16,28.12 70.41,26.36 70.41,23.32 69.11,22.02 67.74,22.02 64.08,18.36 64.08,13.79 65.23,12.65 J7.6
N707
  Bottom 0.152: IC7.6 72.16,26.14 72.16,25.6 70.41,23.85 70.41,18.14 69.04,16.76 69.04,13.79 67.89,12.65 J7.7
N708
  Top 0.152: IC7.7 72.16,23.62 72.16,23.01 70.64,21.49 70.64,16.54 71.55,15.62 71.55,13.79 70.41,12.65 J7.8
N801  (via drill 0.3)
  Top 0.152: v92.73,22.48 92.73,33.83 90.83,35.74 90.83,36.35 IC8.15 | v56.46,6.4 56.46,9.6 53.8,12.27 53.8,13.95 52.65,15.09 J8.1
  Bottom 0.152: v92.73,22.48 92.73,20.57 73.46,1.29 59.66,1.29 56.46,4.5 v56.46,6.4
N802  (via drill 0.3)
  Top 0.152: v88.7,24.54 v88.7,30.18 | v58.14,3.58 58.14,3.81 58.9,4.57 58.9,8.53 56.31,11.12 56.31,13.95 55.17,15.09 J8.2
  Bottom 0.152: v88.7,30.18 88.85,30.33 88.85,34.9 84.89,38.86 83.21,38.86 IC8.1 | v88.7,24.54 88.7,19.13 75.74,6.17 74.91,6.17 74.14,5.41 74.14,4.57 71.17,1.6 60.12,1.6 v58.14,3.58
N803
  Top 0.152: IC8.2 83.13,36.35 82.22,36.35 80.62,34.75 67.82,34.75 62.79,29.72 62.79,28.35 61.57,27.13 56.77,27.13 55.93,26.29 55.93,16.84 57.61,15.16 J8.3
N804  (via drill 0.3)
  Top 0.152: v85.11,23.01 v85.11,24.54 | v70.18,9.07 69.04,7.92 69.04,7.09 68.28,6.33 67.36,6.33 66.52,7.16 66.52,8 v63.32,11.2
  Bottom 0.152: v85.11,24.54 85.11,31.32 83.21,33.22 83.21,33.76 IC8.3 | v85.11,23.01 85.11,20.57 73.61,9.07 v70.18,9.07 | v63.32,11.2 62.48,11.2 61.42,12.27 61.42,13.95 60.27,15.09 J8.4
N805  (via drill 0.3)
  Top 0.152: v74.22,21.18 74.22,25.07 78.79,29.64 80.16,29.64 81.76,31.24 83.13,31.24 IC8.4 | v64.62,16.99 v70.03,16.99
  Bottom 0.152: v70.03,16.99 v74.22,21.18 | v64.62,16.99 62.79,15.16 J8.5
N806
  Top 0.152: IC8.5 83.13,28.73 83.13,28.12 81.38,26.36 81.38,25.83 80.16,24.61 78.79,24.61 74.14,19.96 74.14,12.19 73.38,11.43 69.88,11.43 69.04,12.27 69.04,13.11 68.2,13.95 66.45,13.95 65.3,15.09 J8.6
N807
  Bottom 0.152: IC8.6 83.13,26.21 81.76,26.21 80.85,27.13 71.17,27.13 70.41,26.36 70.41,25.83 69.19,24.61 67.82,24.61 67.21,24 67.21,15.77 J8.7
N808
  Bottom 0.152: IC8.7 83.13,23.62 81.76,23.62 80.16,22.02 77.27,22.02 70.41,15.16 J8.8
N$1
  Top 0.152: RN1.2 51.05,50.52 53.11,50.52 54.63,52.05 56.08,52.05 58.67,54.63 61.42,54.63 63.55,56.77 DZ1.20
N$2
  Bottom 0.152: RN1.3 51.05,53.03 53.11,53.03 54.71,54.63 63.93,54.63 66.06,56.77 DZ1.19
N$3
  Top 0.152: RN1.4 51.05,55.55 53.03,55.55 54.63,57.15 61.95,57.15 63.17,58.37 67.06,58.37 68.58,56.84 DZ1.18
N$4
  Top 0.152: DZ1.17 71.17,56.84 70.56,56.84 68.73,58.67 60.35,58.67 60.05,58.98 51.89,58.98 51.05,58.14 RN1.5
N$5
  Top 0.152: RN2.2 55.02,50.52 57.07,50.52 58.6,52.05 68.96,52.05 73.69,56.77 DZ1.16
N$6
  Bottom 0.152: RN2.3 55.02,53.03 57.07,53.03 58.37,54.33 73.76,54.33 76.2,56.77 DZ1.15
N$7
  Bottom 0.152: RN2.4 55.02,55.55 57.07,55.55 58.67,57.15 61.95,57.15 63.17,58.37 77.27,58.37 78.79,56.84 DZ1.14
N$8
  Bottom 0.152: DZ1.13 81.31,56.84 80.7,56.84 78.56,58.98 55.85,58.98 55.02,58.14 RN2.5
N$9
  Top 0.152: RN3.2 59.05,50.52 60.66,50.52 61.87,51.74 73.84,51.74 74.91,52.81 79.86,52.81 83.82,56.77 DZ1.12
N$10
  Bottom 0.152: RN3.3 59.05,53.03 72.92,53.03 75.13,55.24 84.89,55.24 86.41,56.77 DZ1.11
RCLK  (via drill 0.3)
  Top 0.152: 88.77,34.67 88.77,41.22 89.23,41.68 89.23,46.41 86.49,49.15 DZ1.10 86.49,49.23 86.49,51.05 88.39,52.96 v88.39,57.99 | 88.77,34.67 88.77,33.91 89.76,32.92 91.14,32.92 92.43,31.62 92.43,30.94 90.83,29.34 90.83,28.8 IC8.12 | v59.05,22.63 62.1,22.63 63.4,23.93 v63.4,24.23 | 84.24,32.19 84.2,32.23 71.17,32.23 70.41,31.47 70.41,30.33 68.89,28.8 IC6.12 | 84.24,32.19 84.81,31.62 84.81,30.94 84.2,30.33 82.37,30.33 80.85,28.8 79.86,28.8 IC7.12 | v88.32,34.67 88.77,34.67 | 84.24,32.19 v86.11,34.06 | 49.95,67.02 50.29,66.67 71.48,66.67 72.39,65.76 SV3.5 | 49.95,67.02 49.07,67.89 49.07,68.05 47.85,69.27 47.09,69.27 46.56,68.73 46.56,68.5 45.03,66.98 45.03,65.76 SV2.5 | v18.67,35.59 18.67,35.36 16.23,32.92 14.86,32.92 13.64,31.7 13.64,31.17 11.81,29.34 11.81,28.8 IC1.12 | v20.19,33.91 v20.19,36.88 | IC2.12 22.86,28.8 23.7,29.64 27.2,29.64 28.04,28.8 33.76,28.8 IC3.12 33.83,28.8 35.13,30.1 38.56,30.1 39.85,28.8 v40.16,28.8 | 49.95,67.02 48.46,65.53 48.46,64.62 46.86,63.02 46.86,36.42 45.19,34.75 43.81,34.75 43.2,34.14 43.2,30.4 44.81,28.8 IC4.12
  Bottom 0.152: v59.05,22.63 56.84,22.63 56.24,23.24 56.24,26.59 57.76,28.12 57.76,28.73 IC5.12 | v63.4,24.23 63.86,24.23 64.24,23.85 64.69,23.85 66.9,26.06 66.9,26.82 IC6.12 | v88.32,34.67 86.72,34.67 v86.11,34.06 | v18.67,35.59 18.9,35.59 v20.19,36.88 | v20.19,33.91 20.19,31.39 22.78,28.8 IC2.12 | v40.16,28.8 44.81,28.8 IC4.12 | v88.39,57.99 88.09,57.99 81.31,64.77 73.38,64.77 72.47,65.68 SV3.5
RCLKOUT
  Top 0.152: SV1.5 17.53,65.76 17.53,66.98 19.05,68.5 19.05,68.66 19.66,69.27 20.34,69.27 21.57,68.05 21.57,63.02 23.93,60.66 U$2.P$9
SCLK  (via drill 0.3)
  Top 0.152: IC3.11 26.75,19.13 22.86,19.13 21.26,20.73 21.26,24.08 22.78,25.6 22.78,26.14 IC2.11 | v38.56,37.95 38.56,37.41 40.08,35.89 | 41.19,34.78 42.9,33.07 42.9,28.12 44.81,26.21 IC4.11 | 41.19,34.78 40.08,35.89 | 40.08,35.89 v40.23,36.04 | v68.05,70.1 44.96,70.1 43.13,68.28 42.44,68.28 SV2.4 | v64.01,26.75 68.28,26.75 68.81,26.21 IC6.11 | v86.11,29.64 82.14,29.64 81.61,29.11 81.61,28.57 79.86,26.82 79.86,26.21 IC7.11 | v85.88,50.9 87.33,52.35 87.33,62.41 83.06,66.67 82.83,66.67 81.61,67.89 81.61,68.12 80.47,69.27 72.08,69.27 71.09,68.28 69.95,68.28 SV3.4 | 41.19,34.78 43.66,37.26 v46.33,37.26
  Bottom 0.152: v38.56,37.95 22.02,37.95 18.75,34.67 18.75,32.69 16.38,30.33 14.86,30.33 13.64,29.11 13.64,28.57 11.81,26.75 11.81,26.21 IC1.11 | v40.23,36.04 40.23,34.9 38.25,32.92 33.07,32.92 31.32,31.17 31.32,27.13 32.23,26.21 33.76,26.21 IC3.11 | v68.05,70.1 69.88,68.28 SV3.4 | v64.01,26.75 64.01,27.89 62.26,29.64 60.12,29.64 59.59,29.11 59.59,28.57 57.84,26.82 57.84,26.21 IC5.11 | IC7.11 79.86,26.14 81.31,26.14 82.14,25.3 84.28,25.3 84.81,25.83 84.81,26.52 83.9,27.43 70.1,27.43 68.89,26.21 IC6.11 | 89.23,29.64 89.23,36.73 90.45,37.95 91.82,37.95 92.43,38.56 92.43,40.62 83.9,49.15 DZ1.9 | 89.23,29.64 89.23,28.35 90.75,26.82 90.75,26.21 IC8.11 | 89.23,29.64 v86.11,29.64 | v85.88,50.9 84.05,49.07 DZ1.9 | v46.33,37.26 46.63,37.26 50.44,41.07 53.11,41.07 54.33,42.29 54.33,42.37 55.47,43.51 78.18,43.51 83.82,49.15 DZ1.9
SCLKOUT
  Bottom 0.152: SV1.4 14.94,68.2 14.94,67.06 16.46,65.53 16.46,64.77 20.19,61.04 20.19,60.2 21.03,59.36 25.3,59.36 26.52,60.58 U$2.P$10
SIN1
  Top 0.152: IC1.14 11.81,33.83 13.26,33.83 14.86,35.43 16.23,35.43 16.84,36.04 16.84,44.12 17.68,44.96 17.68,47.47 30.4,60.2 30.4,61.11 36.27,66.98 43.74,66.98 44.96,68.2 SV2.6
  Bottom 0.152: DZ1.1 63.55,49.23 54.18,49.23 51.82,51.59 49.99,51.59 45.95,55.63 45.95,67.28 45.03,68.2 SV2.6
SIN2  (via drill 0.3)
  Top 0.152: v25.6,35.2 30.4,35.2 v32.61,37.41
  Bottom 0.152: v25.6,35.2 24.23,33.83 22.86,33.83 IC2.14 | v32.61,37.41 39.78,37.41 49.38,47.02 63.93,47.02 66.06,49.15 DZ1.2 65.76,48.92 62.79,51.89 50.14,51.89 47.55,54.48 47.55,65.68 SV2.7
SIN3
  Top 0.152: IC3.14 33.83,33.83 33.83,34.44 35.59,36.2 35.59,42.52 38.02,44.96 38.02,51.21 46.56,59.74 46.56,67.28 47.47,68.2 SV2.8
  Bottom 0.152: IC3.14 34.75,34.75 37.57,34.75 46.63,43.81 62.71,43.81 68.05,49.15 68.58,49.15 DZ1.3
SIN4
  Top 0.152: 47.55,49.53 47.55,63.25 49.99,65.68 SV2.9 | 47.55,49.53 47.55,36.65 44.88,33.98 44.88,33.83 IC4.14 | 47.55,49.53 60.12,49.53 61.34,50.75 69.04,50.75 70.56,49.23 71.17,49.23 DZ1.4
SIN5
  Top 0.152: IC5.14 57.84,33.83 58.83,33.83 60.43,35.43 62.26,35.43 73.69,46.86 73.69,49.15 DZ1.5
  Bottom 0.152: SV2.10 50.06,68.2 51.28,68.2 52.81,66.67 53.03,66.67 54.18,65.53 54.18,65.3 60.2,59.28 85.88,59.28 87.33,57.84 87.33,55.78 86.26,54.71 75.06,54.71 73.76,53.42 73.76,49.23 DZ1.5
SIN6  (via drill 0.3)
  Top 0.152: v70.48,35.74 70.48,36.58 71.86,37.95 73.23,37.95 76.2,40.92 76.2,49.15 DZ1.6 | v74.68,53.34 74.68,57.84 73.53,58.98 60.5,58.98 53.8,65.68 52.65,65.68 SV2.11
  Bottom 0.152: v70.48,35.74 68.89,34.14 68.89,33.83 IC6.14 | v74.68,53.34 74.68,50.75 76.2,49.23 DZ1.6
SIN7  (via drill 0.3)
  Top 0.152: v78.26,35.66 78.26,41.22 78.79,41.76 78.79,49.15 DZ1.7 | v87.86,55.85 87.86,64.39 82.68,69.57 55.02,69.57 53.72,68.28 52.65,68.28 SV2.12
  Bottom 0.152: v78.26,35.66 79.78,34.14 79.78,33.83 IC7.14 | v87.86,55.85 83.74,51.74 81.38,51.74 78.87,49.23 DZ1.7
SIN8
  Bottom 0.152: 86.14,51.4 86.11,51.44 83.59,51.44 81.38,49.23 DZ1.8 | 86.14,51.4 92.73,44.81 92.73,36.35 90.83,34.44 90.83,33.83 IC8.14 | 86.14,51.4 88.39,53.65 88.39,57.23 86.03,59.59 72.16,59.59 66.06,65.68 55.17,65.68 SV2.13
SOUT1
  Bottom 0.152: SV1.6 17.53,68.2 17.53,67.06 19.05,65.53 19.05,63.02 21.41,60.66 U$2.P$8
SOUT2
  Top 0.152: SV1.7 19.96,65.68 19.96,61.65 18.97,60.66 U$2.P$7
SOUT3
  Top 0.152: SV1.8 19.96,68.2 19.96,67.06 18.44,65.53 18.44,62.71 16.38,60.66 U$2.P$6
SOUT4
  Bottom 0.152: SV1.9 22.55,65.68 23.16,65.68 27.74,61.11 27.74,60.12 26.67,59.05 15.39,59.05 13.87,60.58 U$2.P$5
SOUT5
  Bottom 0.152: SV1.10 22.55,68.2 23.77,68.2 24.84,67.13 27.58,67.13 30.33,64.39 30.33,60.12 28.96,58.75 13.18,58.75 11.35,60.58 U$2.P$4
SOUT6
  Top 0.152: SV1.11 25.07,65.76 25.07,66.9 23.55,68.43 23.55,68.66 22.63,69.57 17.37,69.57 15.93,68.12 15.93,67.89 14.71,66.67 14.48,66.67 13.34,65.53 13.34,65.23 8.76,60.66 U$2.P$3
SOUT7
  Top 0.152: SV1.12 24.38,68.28 22.78,69.88 15.16,69.88 13.34,68.05 13.34,67.89 12.12,66.67 11.51,66.67 6.25,61.42 6.25,60.66 U$2.P$2
SOUT8
  Bottom 0.152: SV1.13 27.58,65.76 26.44,65.76 25.38,66.83 20.04,66.83 18.44,68.43 18.44,68.66 17.83,69.27 14.55,69.27 13.34,68.05 13.34,67.89 12.12,66.67 11.96,66.67 8.53,63.25 8.53,62.18 8.23,61.87 4.95,61.87 3.73,60.66 U$2.P$1
VCC  (via drill 0.3)
  Top 0.305: v8,62.41 11.28,65.68 12.34,65.68 SV1.1 | J9.+ 14.17,16.69 9.3,21.57 9.3,41.99 C1.1 | IC5.16 57.76,38.94 55.78,38.94 52.73,41.99 C5.1 | IC4.16 44.81,38.94 42.82,38.94 39.78,41.99 C4.1 | IC3.16 33.76,38.94 32.08,38.94 28.96,42.06 C3.1 28.8,42.06 28.8,42.6 31.55,45.34 U$2.P$23 31.7,45.49 45.64,59.44 45.64,61.11 44.81,61.95 44.73,61.95 41,65.68 39.93,65.68 SV2.1
  Bottom 0.305: 9.3,41.38 9.3,41.99 C1.1 | 9.3,41.38 11.73,38.94 IC1.16 11.89,39.01 14.78,41.91 17.6,41.91 C2.1 17.75,41.99 20.8,38.94 22.78,38.94 IC2.16 22.94,38.94 24.16,38.94 26.82,41.6 28.35,41.6 28.73,41.99 C3.1 | v8,62.41 3.66,62.41 2.36,61.11 2.36,44.88 6.25,41 8.91,41 9.3,41.38 | IC8.16 90.75,38.94 89.92,38.94 86.87,41.99 85.8,41.99 C8.1 85.57,41.99 84.2,41.99 81.15,38.94 79.93,38.94 IC7.16 79.78,38.94 78.49,38.94 75.44,41.99 74.75,41.99 C7.1 74.6,41.91 71.93,41.91 68.96,38.94 IC6.16 68.81,38.94 66.83,38.94 63.78,41.99 C6.1 63.63,41.91 62.18,41.91 59.21,38.94 57.84,38.94 IC5.16 | SV3.1 67.36,65.76 66.6,65.76 65.46,66.9 55.02,66.9 53.65,68.28 53.65,68.66 52.96,69.34 44.58,69.34 43.51,68.28 43.51,67.89 42.37,66.75 40.92,66.75 39.93,65.76 SV2.1 | C4.1 39.7,41.99 36.88,41.99 33.83,38.94 IC3.16 | C5.1 52.65,41.99 47.93,41.99 44.88,38.94 IC4.16
XOUT1
  Top 0.152: IC1.9 11.73,21.18 11.73,21.79 10.21,23.32 10.21,44.73 9.98,44.96 9.98,55.17 4.95,60.2 4.95,62.18 12.95,70.18 39.32,70.18 41.45,68.05 41.45,67.89 42.06,67.28 42.82,67.28 43.97,68.43 43.97,68.66 44.88,69.57 50.14,69.57 51.59,68.12 51.59,67.89 52.2,67.28 71.48,67.28 72.39,68.2 SV3.6
XOUT2  (via drill 0.3)
  Top 0.152: v53.19,33.68 57.45,37.95 58.83,37.95 59.59,38.71 59.59,39.24 67.44,47.09 71.02,47.09 72.77,48.84 72.77,50.22 74.83,52.27 v75.21,52.27 | v75.21,54.1 75.21,65.53 75.06,65.68 SV3.7
  Bottom 0.152: v53.19,33.68 53.19,21.72 41.76,10.29 30.33,10.29 28.5,12.12 28.5,12.95 27.66,13.79 26.82,13.79 25.98,14.63 25.98,15.47 22.86,18.59 22.86,21.11 IC2.9 | v75.21,54.1 v75.21,52.27
XOUT3  (via drill 0.3)
  Top 0.152: v38.94,28.19 38.94,25.98 38.25,25.3 36.88,25.3 35.59,24 35.59,23.47 33.83,21.72 33.83,21.18 IC3.9 | v40.77,37.19 40.77,39.7 38.79,41.68 38.79,42.9 v40.46,44.58
  Bottom 0.152: v38.94,28.19 38.94,33.15 40.77,34.98 v40.77,37.19 | v40.46,44.58 40.46,63.32 38.63,65.15 38.63,68.89 40.39,70.64 72.62,70.64 74.98,68.28 SV3.8
XOUT4  (via drill 0.3)
  Top 0.152: v67.51,47.62 60.96,41.07 54.94,41.07 53.11,42.9 52.27,42.9 48.31,38.94 48.31,25.22 44.88,21.79 44.88,21.18 IC4.9 | v77.8,53.34 77.8,53.49 77.34,53.95 77.34,65.53 77.5,65.68 SV3.9
  Bottom 0.152: v67.51,47.62 76.66,47.62 77.8,48.77 v77.8,53.34
XOUT5  (via drill 0.3)
  Top 0.152: v55.93,28.12 55.93,31.32 57.53,32.92 58.9,32.92 59.59,33.6 59.59,34.14 60.58,35.13 62.41,35.13 75.21,47.93 v75.21,51.51 | v77.88,54.18 77.88,64.69 78.49,65.3 78.49,67.28 77.57,68.2 SV3.10
  Bottom 0.152: v55.93,28.12 55.93,23.01 57.76,21.18 IC5.9 | v77.88,54.18 v75.21,51.51
XOUT6  (via drill 0.3)
  Top 0.152: v66.67,20.19 67.59,21.11 IC6.9 | v77.72,36.8 77.72,41.15 78.18,41.6 78.18,47.85 77.88,48.16 77.88,50.22 82.91,55.24 84.28,55.24 84.81,55.78 84.81,60.96 80.09,65.68 SV3.11
  Bottom 0.152: v66.67,20.19 66.67,25.38 67.21,25.91 67.21,26.52 68.5,27.81 76.96,27.81 79.48,30.33 80.85,30.33 81.38,30.86 81.38,31.62 80.09,32.92 78.72,32.92 77.72,33.91 v77.72,36.8
XOUT7
  Top 0.152: IC7.9 79.86,21.18 81.31,21.18 82.6,22.48 85.34,22.48 86.94,24.08 86.94,46.25 85.04,48.16 85.04,55.55 85.11,55.63 85.11,61.87 81.08,65.91 81.08,67.21 80.09,68.2 SV3.12
XOUT8
  Top 0.152: IC8.9 90.75,21.18 90.75,21.72 87.25,25.22 87.25,46.41 85.34,48.31 85.34,55.4 85.42,55.47 85.42,62.94 82.68,65.68 SV3.13

### Text on the board
tNames: MC1 | INPUT | 1 | 2 | 3 | 4 | 5 | 6 | 7 | 8 | C | L | USB | Arduino Micro | A | Pineapple 128 1.0.0-X | For Necobit DT-8 R3 | DC5V1A | GND | 1 | 2 | 3 | 4 | 5 | 6 | 7 | 8 | G | G | 1 | 2 | 3 | 4 | 5 | 6 | 7 | 8 | G | G
bNames: OUT | IN | THRU